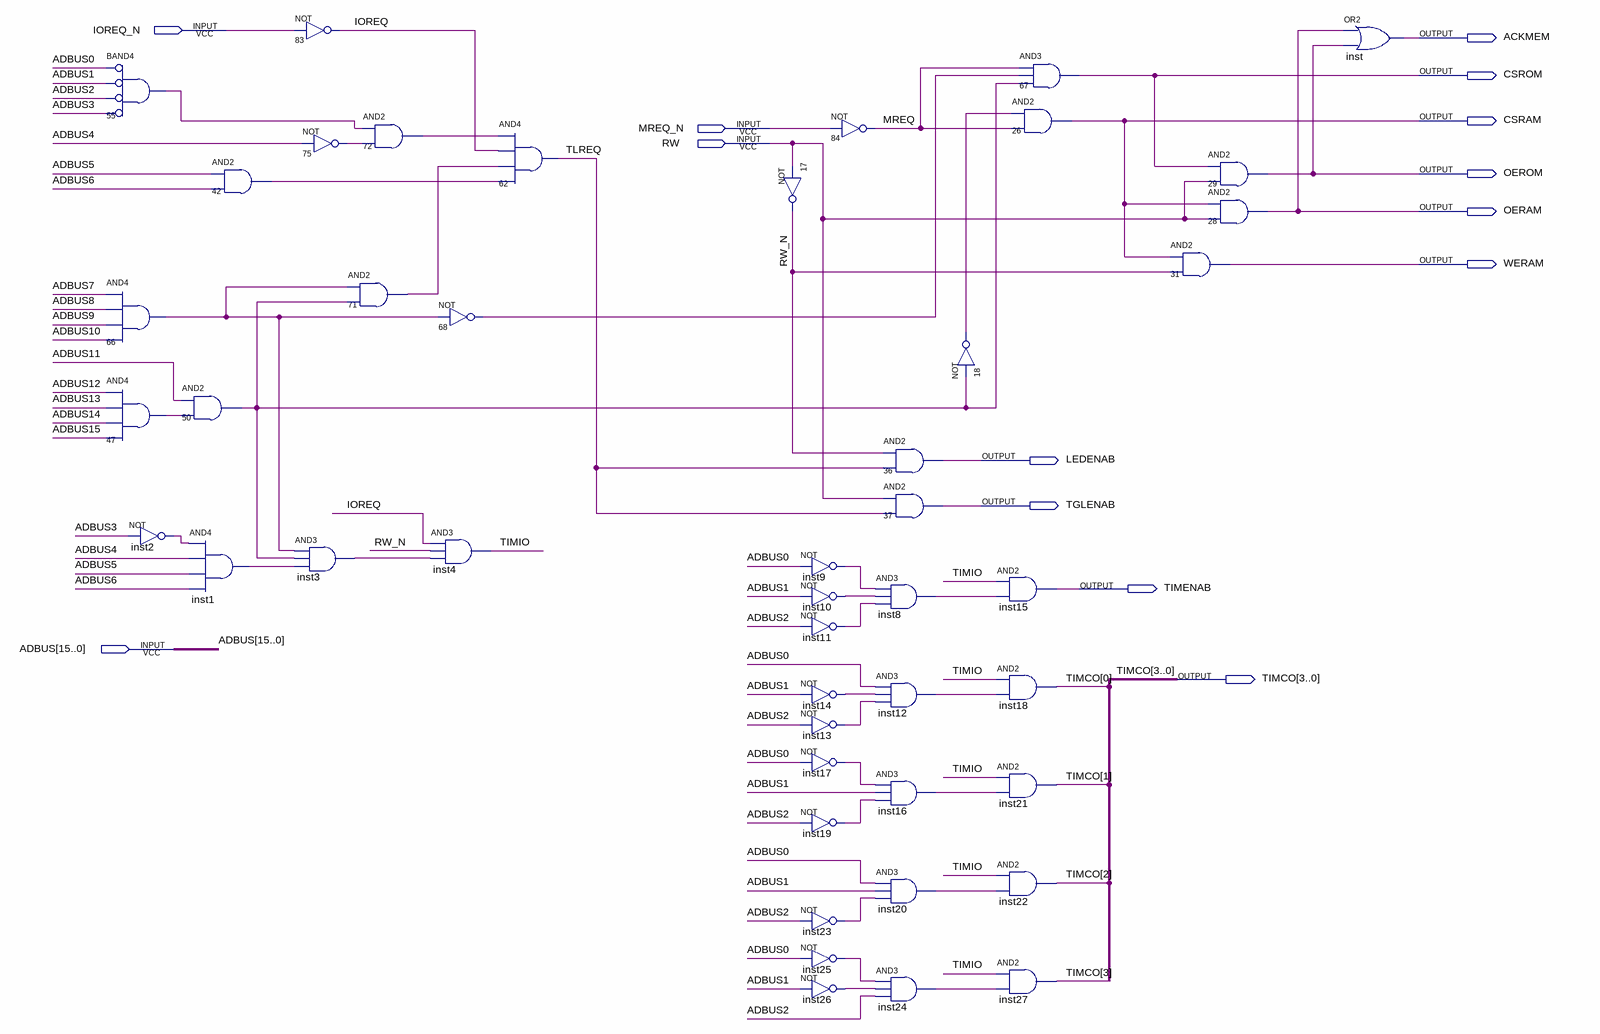
[diagram p0: schematic sheet]
// Quartus schematic sep5_memorycontrol_timer.bdf as structural Verilog: 46 symbols, 14 pins
module sep5_memorycontrol_timer (
  input  IOREQ_N,
  input  MREQ_N,
  input  RW,
  input  [15:0] ADBUS,
  output ACKMEM,
  output CSROM,
  output CSRAM,
  output OEROM,
  output OERAM,
  output WERAM,
  output LEDENAB,
  output TGLENAB,
  output TIMENAB,
  output [3:0] TIMCO
);

  wire inst1_out, inst2_out, inst3_out, inst8_out, inst9_out, inst10_out, inst11_out, inst12_out, inst13_out,
       inst14_out, inst16_out, inst17_out, inst19_out, inst20_out, inst23_out, inst24_out, inst25_out,
       inst26_out, IOREQ, MREQ, n18_out, n42_out, n47_out, n50_out, n55_out, n66_out, n68_out, n71_out,
       n72_out, n75_out, RW_N, TIMIO, TLREQ;

  and u_55 (n55_out, ~ADBUS[0], ~ADBUS[1], ~ADBUS[2], ~ADBUS[3]);  // BAND4
  and u_66 (n66_out, ADBUS[7], ADBUS[8], ADBUS[9], ADBUS[10]);
  and u_47 (n47_out, ADBUS[12], ADBUS[13], ADBUS[14], ADBUS[15]);
  and u_50 (n50_out, ADBUS[11], n47_out);
  not inst2 (inst2_out, ADBUS[3]);
  and u_42 (n42_out, ADBUS[5], ADBUS[6]);
  and inst1 (inst1_out, inst2_out, ADBUS[4], ADBUS[5], ADBUS[6]);
  not u_83 (IOREQ, IOREQ_N);
  not u_75 (n75_out, ADBUS[4]);
  and inst3 (inst3_out, n66_out, n50_out, inst1_out);
  and u_72 (n72_out, n55_out, n75_out);
  and u_71 (n71_out, n66_out, n50_out);
  not u_68 (n68_out, n66_out);
  and inst4 (TIMIO, IOREQ, RW_N, inst3_out);
  and u_62 (TLREQ, n72_out, IOREQ, n71_out, n42_out);
  not u_17 (RW_N, RW);
  not u_84 (MREQ, MREQ_N);
  not inst9 (inst9_out, ADBUS[0]);
  not inst10 (inst10_out, ADBUS[1]);
  not inst11 (inst11_out, ADBUS[2]);
  not inst14 (inst14_out, ADBUS[1]);
  not inst13 (inst13_out, ADBUS[2]);
  not inst17 (inst17_out, ADBUS[0]);
  not inst19 (inst19_out, ADBUS[2]);
  not inst23 (inst23_out, ADBUS[2]);
  not inst25 (inst25_out, ADBUS[0]);
  not inst26 (inst26_out, ADBUS[1]);
  and u_36 (LEDENAB, RW_N, TLREQ);
  and u_37 (TGLENAB, RW, TLREQ);
  and inst8 (inst8_out, inst9_out, inst10_out, inst11_out);
  and inst12 (inst12_out, ADBUS[0], inst14_out, inst13_out);
  and inst16 (inst16_out, inst17_out, ADBUS[1], inst19_out);
  and inst20 (inst20_out, ADBUS[0], ADBUS[1], inst23_out);
  and inst24 (inst24_out, inst25_out, inst26_out, ADBUS[2]);
  not u_18 (n18_out, n50_out);
  and u_67 (CSROM, MREQ, n68_out, n50_out);
  and u_26 (CSRAM, n18_out, MREQ);
  and inst15 (TIMENAB, TIMIO, inst8_out);
  and inst18 (TIMCO[0], TIMIO, inst12_out);
  and inst21 (TIMCO[1], TIMIO, inst16_out);
  and inst22 (TIMCO[2], TIMIO, inst20_out);
  and inst27 (TIMCO[3], TIMIO, inst24_out);
  and u_29 (OEROM, CSROM, RW);
  and u_28 (OERAM, CSRAM, RW);
  and u_31 (WERAM, CSRAM, RW_N);
  or inst (ACKMEM, OERAM, OEROM);
endmodule
